# Altium project UD3.1.PrjPCB (part 2 of 2)
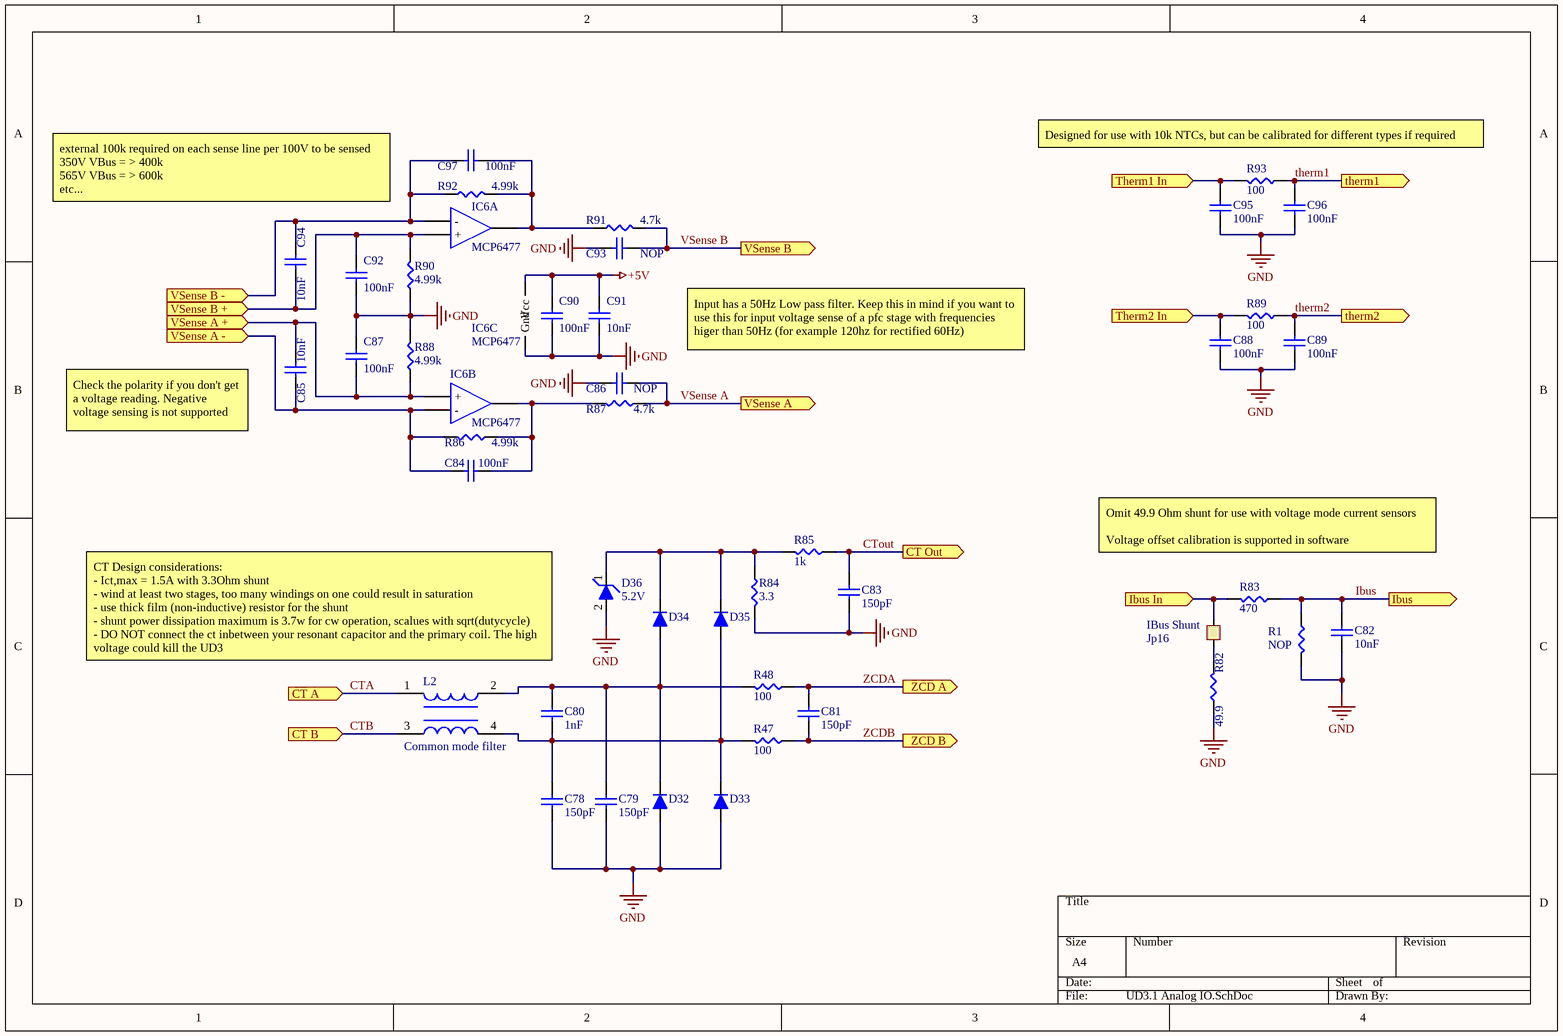
[diagram p7: UD3.1 Analog IO.SchDoc]

## Nets that join several sheets
+5V: UD3.1 Bootstrap Gate Driver (Jp2.2 Jp5.2 Jp6.2 Jp9.2), UD3.1 (8 pins), UD3.1 Supplies (9 pins), UD3.1 PSOC (21 pins), UD3.1 N+P Gate Driver (6 pins), UD3.1 Analog IO (C90.2 C91.2 IC6.8)
+12V: UD3.1 (Jp11.2), UD3.1 Supplies (7 pins)
+24V: UD3.1 (13 pins), UD3.1 Supplies (13 pins), UD3.1 PSOC (C6.2 J?.1)
+VDrive: UD3.1 Bootstrap Gate Driver (17 pins), UD3.1 Supplies (7 pins), UD3.1 PSOC (J?.9), UD3.1 N+P Gate Driver (23 pins)
-12V: UD3.1 (J16.2), UD3.1 Supplies (C37.2 C38.2 D4.2 U1.5)
GND: UD3.1 Bootstrap Gate Driver (42 pins), UD3.1 (19 pins), UD3.1 Supplies (38 pins), UD3.1 PSOC (32 pins), UD3.1 Digital IO (27 pins), UD3.1 N+P Gate Driver (40 pins), UD3.1 Analog IO (23 pins)
CTA: UD3.1 (J14.1), UD3.1 Analog IO (L2.1)
CTB: UD3.1 (J14.2), UD3.1 Analog IO (L2.3)
CTout: UD3.1 PSOC (MCU1.1), UD3.1 Analog IO (C83.1 R85.1)
DigiPot Clk: UD3.1 Supplies (IC1.4), UD3.1 PSOC (J1.8 MCU1.82)
DigiPot Mosi: UD3.1 Supplies (IC1.5), UD3.1 PSOC (J1.7 MCU1.83)
DigiPot nCS: UD3.1 Supplies (IC1.6), UD3.1 PSOC (J1.6 MCU1.84)
E3.9: UD3.1 Supplies (R13.2 Reg2.8), UD3.1 PSOC (J1.9 MCU1.81)
FAN: UD3.1 PSOC (MCU1.31), UD3.1 Digital IO (R98.1 R105.1)
GD1A: UD3.1 PSOC (J?.5 MCU1.7), UD3.1 N+P Gate Driver (R157.1 R169.1)
GD1B: UD3.1 PSOC (J?.6 MCU1.6), UD3.1 N+P Gate Driver (R156.1 R168.1)
GD2A: UD3.1 PSOC (J?.3 MCU1.9), UD3.1 N+P Gate Driver (R132.1 R143.1)
GD2B: UD3.1 PSOC (J?.4 MCU1.8), UD3.1 N+P Gate Driver (R131.1 R144.1)
Ibus: UD3.1 PSOC (MCU1.80), UD3.1 Analog IO (C82.2 R1.1 R83.1)
LED1: UD3.1 PSOC (MCU1.53), UD3.1 Digital IO (R100.1 R106.1)
LED2: UD3.1 PSOC (MCU1.54), UD3.1 Digital IO (R109.1 R110.1)
LED3: UD3.1 PSOC (MCU1.55), UD3.1 Digital IO (R119.1 R120.1)
LED4: UD3.1 PSOC (MCU1.56), UD3.1 Digital IO (R127.1 R128.1)
NetC84_1: UD3.1 (J17.4), UD3.1 Analog IO (C84.1 C85.1 IC6.6 R86.1)
NetC85_2: UD3.1 (J17.3), UD3.1 Analog IO (C85.2 C87.1 IC6.5 R88.1)
NetC88_2: UD3.1 (J15.3), UD3.1 Analog IO (C88.2 R89.2)
NetC92_2: UD3.1 (J17.1), UD3.1 Analog IO (C92.2 C94.1 IC6.3 R90.2)
NetC94_2: UD3.1 (J17.2), UD3.1 Analog IO (C94.2 C97.1 IC6.2 R92.1)
NetC95_2: UD3.1 (J15.1), UD3.1 Analog IO (C95.2 R93.2)
NetC100_2: UD3.1 (J11.2), UD3.1 N+P Gate Driver (5 pins)
NetC102_2: UD3.1 (J11.1), UD3.1 N+P Gate Driver (C102.2 R145.2)
NetC116_2: UD3.1 (J12.1), UD3.1 N+P Gate Driver (5 pins)
NetC118_2: UD3.1 (J12.2), UD3.1 N+P Gate Driver (C118.2 R170.2)
NetJ16_3: UD3.1 (J16.3), UD3.1 Analog IO (Jp16.2 R83.2)
Relay1: UD3.1 PSOC (MCU1.32), UD3.1 Digital IO (R101.1 R124.1)
Relay1 Out: UD3.1 (D39.1 J21.2), UD3.1 Digital IO (R129.2)
Relay2: UD3.1 PSOC (MCU1.33), UD3.1 Digital IO (R102.1 R125.1)
Relay2 Out: UD3.1 (D40.1 J22.2), UD3.1 Digital IO (R130.2)
Relay3: UD3.1 PSOC (MCU1.27), UD3.1 Digital IO (R103.1 R113.1)
Relay3 Out: UD3.1 (D41.1 J23.2), UD3.1 Digital IO (R116.2)
Relay4: UD3.1 PSOC (MCU1.29), UD3.1 Digital IO (R104.1 R114.1)
Relay4 Out: UD3.1 (D42.1 J24.2), UD3.1 Digital IO (R117.2)
RX: UD3.1 (J10.2), UD3.1 PSOC (MCU1.47)
RXen: UD3.1 (J10.3), UD3.1 PSOC (MCU1.46)
therm1: UD3.1 PSOC (MCU1.96), UD3.1 Analog IO (C96.2 R93.1)
therm2: UD3.1 PSOC (MCU1.95), UD3.1 Analog IO (C89.2 R89.1)
TX: UD3.1 (J10.5), UD3.1 PSOC (MCU1.44)
TXen: UD3.1 (J10.4), UD3.1 PSOC (MCU1.45)
USB D+: UD3.1 (R94.1), UD3.1 PSOC (MCU1.35)
USB D-: UD3.1 (R95.1), UD3.1 PSOC (MCU1.36)
UVLO: UD3.1 PSOC (MCU1.28 MCU1.30), UD3.1 N+P Gate Driver (C110.2 R154.1 R155.2)
VSense A: UD3.1 PSOC (MCU1.72), UD3.1 Analog IO (C86.2 R87.2)
VSense B: UD3.1 PSOC (MCU1.71), UD3.1 Analog IO (C93.2 R91.2)
ZCDA: UD3.1 PSOC (MCU1.3), UD3.1 Analog IO (C81.1 R48.1)
ZCDB: UD3.1 PSOC (MCU1.2), UD3.1 Analog IO (C81.2 R47.1)
⎐ Fan Out: UD3.1 (D38.1 J25.1 J26.1), UD3.1 Digital IO (Q6.D)
⎐ LED1 Out: UD3.1 (J28.1), UD3.1 Digital IO (R97.1)
⎐ LED2 Out: UD3.1 (J20.1), UD3.1 Digital IO (R107.1)
⎐ LED3 Out: UD3.1 (J19.1), UD3.1 Digital IO (R115.1)
⎐ LED4 Out: UD3.1 (J18.1), UD3.1 Digital IO (R121.1)